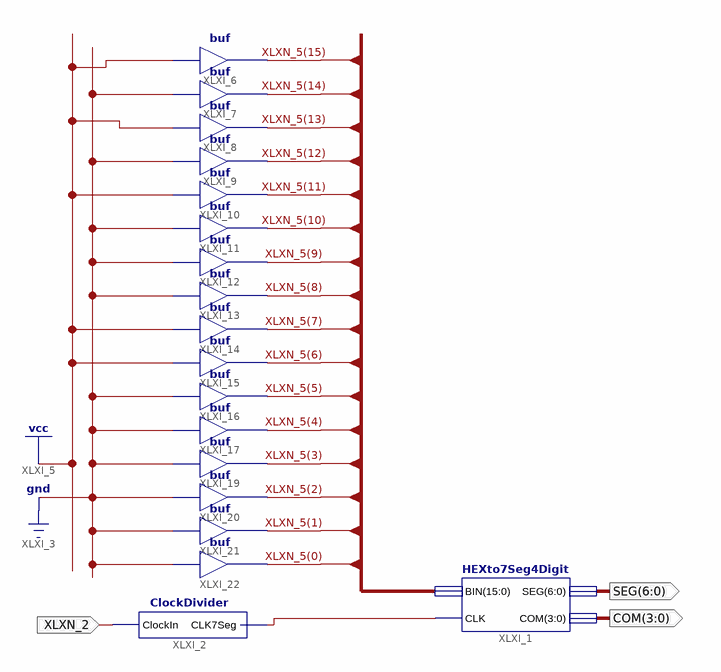
[diagram p0: schematic sheet 1]
// Xilinx ISE schematic abcd.sch (spartan6) as structural Verilog: 18 symbols, 3 ports
module abcd (
  input  XLXN_2,
  output [3:0] COM,
  output [6:0] SEG
);

  wire XLXN_1;
  wire [15:0] XLXN_5;

  ClockDivider XLXI_2 (.ClockIn(XLXN_2), .CLK7Seg(XLXN_1));
  buf XLXI_6 (XLXN_5[15], 1'b1);
  buf XLXI_7 (XLXN_5[14], 1'b0);
  buf XLXI_8 (XLXN_5[13], 1'b1);
  buf XLXI_9 (XLXN_5[12], 1'b0);
  buf XLXI_10 (XLXN_5[11], 1'b1);
  buf XLXI_11 (XLXN_5[10], 1'b0);
  buf XLXI_12 (XLXN_5[9], 1'b0);
  buf XLXI_13 (XLXN_5[8], 1'b0);
  buf XLXI_14 (XLXN_5[7], 1'b1);
  buf XLXI_15 (XLXN_5[6], 1'b1);
  buf XLXI_16 (XLXN_5[5], 1'b0);
  buf XLXI_17 (XLXN_5[4], 1'b0);
  buf XLXI_19 (XLXN_5[3], 1'b0);
  buf XLXI_20 (XLXN_5[2], 1'b0);
  buf XLXI_21 (XLXN_5[1], 1'b0);
  buf XLXI_22 (XLXN_5[0], 1'b0);
  HEXto7Seg4Digit XLXI_1 (.BIN(XLXN_5), .CLK(XLXN_1), .SEG(SEG), .COM(COM));
endmodule
